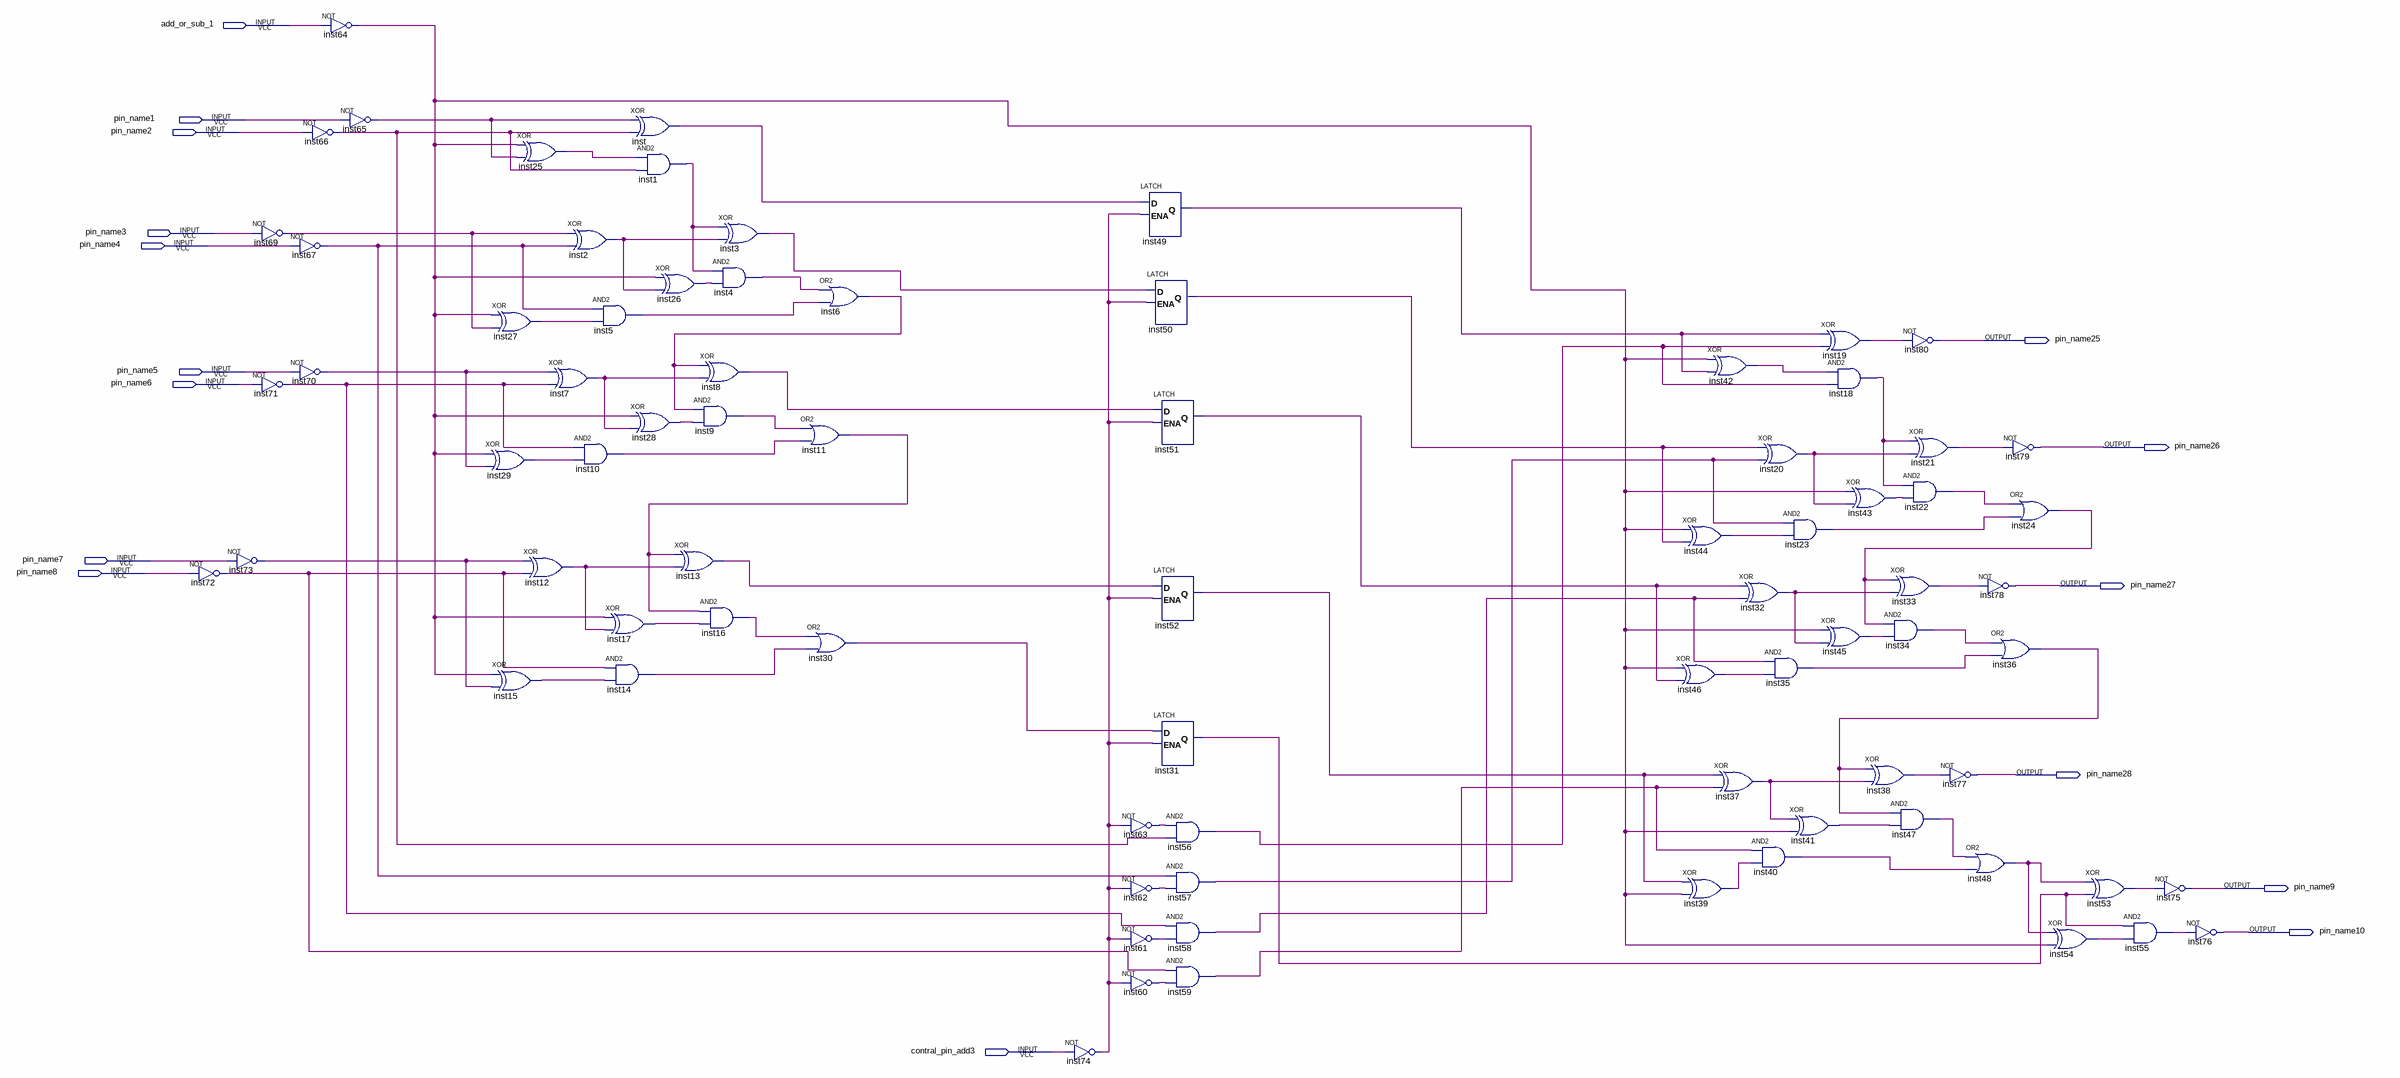
[diagram p0: schematic sheet]
// Quartus schematic lab_5.bdf as structural Verilog: 80 symbols, 16 pins
module lab_5 (
  input  add_or_sub_1,
  input  pin_name1,
  input  pin_name2,
  input  pin_name3,
  input  pin_name4,
  input  pin_name5,
  input  pin_name6,
  input  pin_name7,
  input  pin_name8,
  input  contral_pin_add3,
  output pin_name25,
  output pin_name26,
  output pin_name27,
  output pin_name28,
  output pin_name9,
  output pin_name10
);

  wire inst1_out, inst2_out, inst3_out, inst4_out, inst5_out, inst6_out, inst7_out, inst8_out, inst9_out,
       inst10_out, inst11_out, inst12_out, inst13_out, inst14_out, inst15_out, inst16_out, inst17_out,
       inst18_out, inst19_out, inst20_out, inst21_out, inst22_out, inst23_out, inst24_out, inst25_out,
       inst26_out, inst27_out, inst28_out, inst29_out, inst30_out, inst31_q, inst32_out, inst33_out,
       inst34_out, inst35_out, inst36_out, inst37_out, inst38_out, inst39_out, inst40_out, inst41_out,
       inst42_out, inst43_out, inst44_out, inst45_out, inst46_out, inst47_out, inst48_out, inst49_q,
       inst50_q, inst51_q, inst52_q, inst53_out, inst54_out, inst55_out, inst56_out, inst57_out, inst58_out,
       inst59_out, inst60_out, inst61_out, inst62_out, inst63_out, inst64_out, inst65_out, inst66_out,
       inst67_out, inst69_out, inst70_out, inst71_out, inst72_out, inst73_out, inst74_out, inst_out;

  not inst73 (inst73_out, pin_name7);
  not inst72 (inst72_out, pin_name8);
  not inst69 (inst69_out, pin_name3);
  not inst71 (inst71_out, pin_name6);
  not inst64 (inst64_out, add_or_sub_1);
  not inst66 (inst66_out, pin_name2);
  not inst67 (inst67_out, pin_name4);
  not inst70 (inst70_out, pin_name5);
  not inst65 (inst65_out, pin_name1);
  xor inst25 (inst25_out, inst64_out, inst65_out);
  xor inst27 (inst27_out, inst64_out, inst69_out);
  xor inst29 (inst29_out, inst64_out, inst70_out);
  xor inst12 (inst12_out, inst73_out, inst72_out);
  xor inst15 (inst15_out, inst64_out, inst73_out);
  xor inst2 (inst2_out, inst69_out, inst67_out);
  xor inst7 (inst7_out, inst70_out, inst71_out);
  and inst10 (inst10_out, inst71_out, inst29_out);
  xor inst (inst_out, inst65_out, inst66_out);
  and inst5 (inst5_out, inst67_out, inst27_out);
  xor inst28 (inst28_out, inst64_out, inst7_out);
  xor inst17 (inst17_out, inst64_out, inst12_out);
  and inst14 (inst14_out, inst72_out, inst15_out);
  and inst1 (inst1_out, inst25_out, inst66_out);
  xor inst26 (inst26_out, inst64_out, inst2_out);
  xor inst13 (inst13_out, inst11_out, inst12_out);
  xor inst3 (inst3_out, inst1_out, inst2_out);
  and inst4 (inst4_out, inst1_out, inst26_out);
  xor inst8 (inst8_out, inst6_out, inst7_out);
  and inst9 (inst9_out, inst6_out, inst28_out);
  and inst16 (inst16_out, inst11_out, inst17_out);
  or inst6 (inst6_out, inst4_out, inst5_out);
  or inst11 (inst11_out, inst9_out, inst10_out);
  or inst30 (inst30_out, inst16_out, inst14_out);
  not inst74 (inst74_out, contral_pin_add3);
  not inst63 (inst63_out, inst74_out);
  not inst62 (inst62_out, inst74_out);
  not inst61 (inst61_out, inst74_out);
  not inst60 (inst60_out, inst74_out);
  LATCH inst49 (.D(inst_out), .ENA(inst74_out), .Q(inst49_q));
  LATCH inst50 (.D(inst3_out), .ENA(inst74_out), .Q(inst50_q));
  LATCH inst51 (.D(inst8_out), .ENA(inst74_out), .Q(inst51_q));
  LATCH inst52 (.D(inst13_out), .ENA(inst74_out), .Q(inst52_q));
  LATCH inst31 (.D(inst30_out), .ENA(inst74_out), .Q(inst31_q));
  and inst56 (inst56_out, inst63_out, inst66_out);
  and inst57 (inst57_out, inst67_out, inst62_out);
  and inst58 (inst58_out, inst71_out, inst61_out);
  and inst59 (inst59_out, inst72_out, inst60_out);
  xor inst44 (inst44_out, inst64_out, inst50_q);
  xor inst46 (inst46_out, inst64_out, inst51_q);
  xor inst39 (inst39_out, inst52_q, inst64_out);
  xor inst42 (inst42_out, inst64_out, inst49_q);
  xor inst32 (inst32_out, inst51_q, inst58_out);
  xor inst37 (inst37_out, inst52_q, inst59_out);
  xor inst20 (inst20_out, inst50_q, inst57_out);
  and inst23 (inst23_out, inst57_out, inst44_out);
  and inst35 (inst35_out, inst58_out, inst46_out);
  xor inst41 (inst41_out, inst37_out, inst64_out);
  and inst40 (inst40_out, inst59_out, inst39_out);
  xor inst19 (inst19_out, inst49_q, inst56_out);
  and inst18 (inst18_out, inst42_out, inst56_out);
  xor inst45 (inst45_out, inst64_out, inst32_out);
  xor inst43 (inst43_out, inst64_out, inst20_out);
  xor inst33 (inst33_out, inst24_out, inst32_out);
  and inst34 (inst34_out, inst24_out, inst45_out);
  xor inst38 (inst38_out, inst36_out, inst37_out);
  and inst47 (inst47_out, inst36_out, inst41_out);
  not inst80 (pin_name25, inst19_out);
  xor inst21 (inst21_out, inst18_out, inst20_out);
  and inst22 (inst22_out, inst18_out, inst43_out);
  not inst77 (pin_name28, inst38_out);
  not inst78 (pin_name27, inst33_out);
  or inst36 (inst36_out, inst34_out, inst35_out);
  or inst48 (inst48_out, inst47_out, inst40_out);
  not inst79 (pin_name26, inst21_out);
  or inst24 (inst24_out, inst22_out, inst23_out);
  xor inst53 (inst53_out, inst48_out, inst31_q);
  xor inst54 (inst54_out, inst48_out, inst64_out);
  and inst55 (inst55_out, inst31_q, inst54_out);
  not inst75 (pin_name9, inst53_out);
  not inst76 (pin_name10, inst55_out);
endmodule
